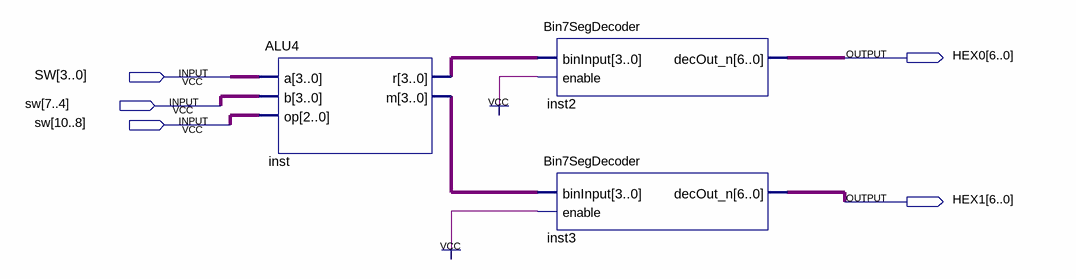
[diagram p0: schematic sheet]
// Quartus schematic ALUDemo.bdf as structural Verilog: 3 symbols, 5 pins
module ALUDemo (
  input  [10:0] SW,
  output [6:0] HEX0,
  output [6:0] HEX1
);

  wire [3:0] inst_m, inst_r;

  ALU4 inst (.a(SW[3:0]), .b(SW[7:4]), .op(SW[10:8]), .r(inst_r), .m(inst_m));
  Bin7SegDecoder inst2 (.binInput(inst_r), .enable(1'b1), .decOut_n(HEX0));
  Bin7SegDecoder inst3 (.binInput(inst_m), .enable(1'b1), .decOut_n(HEX1));
endmodule
